# Altium project LEDTapePiHat.PrjPcb
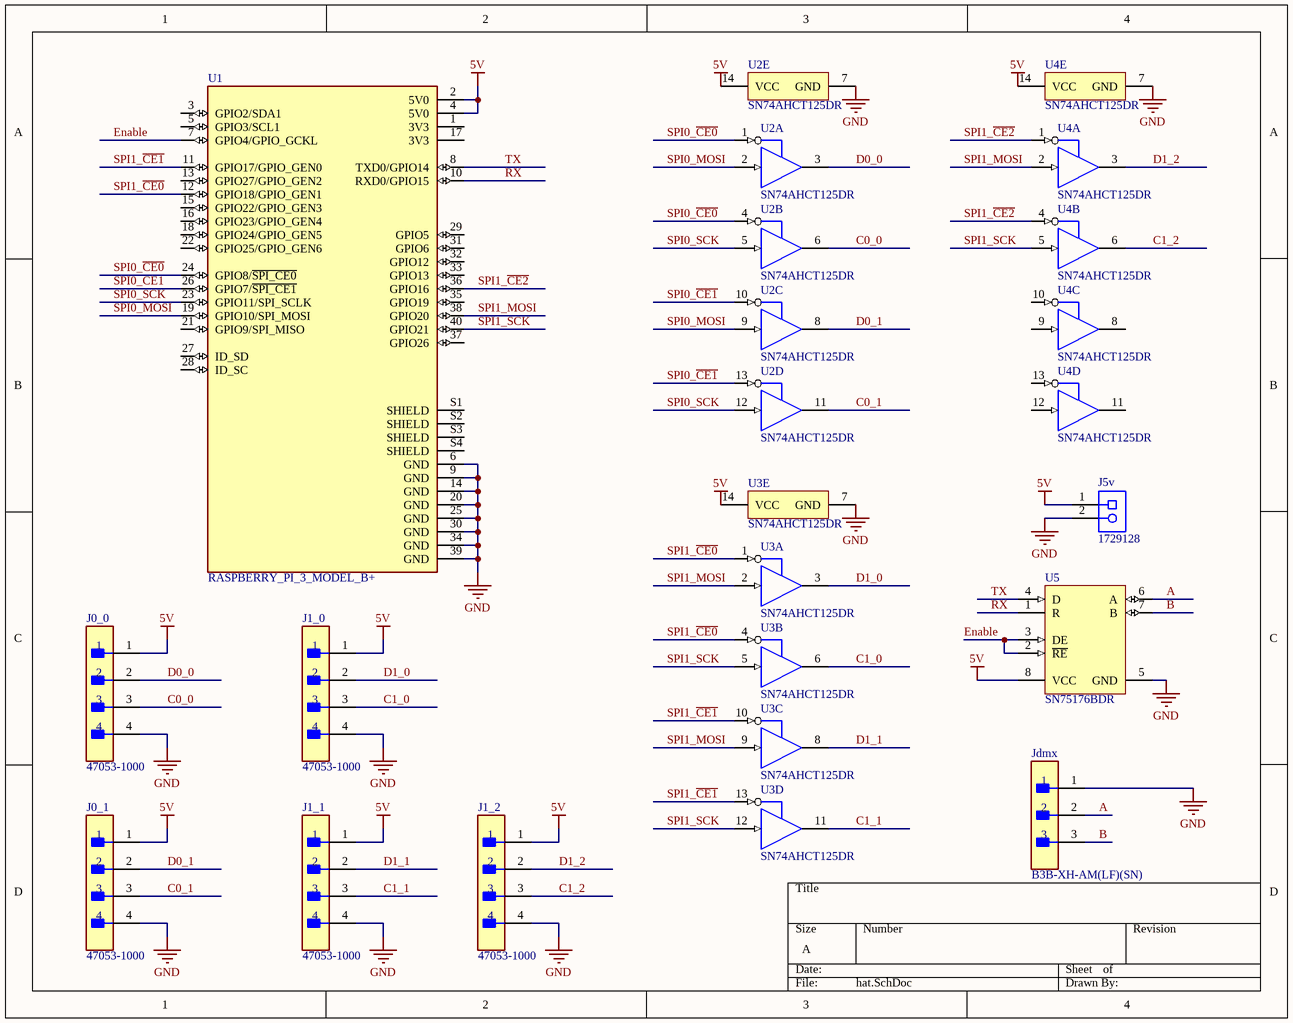
[diagram p0: hat.SchDoc]
1 sheet, 12 parts. Net scope: global (net labels, ports and power ports of the same name join across sheets).
Board file: hat.PcbDoc

## Sheet hat.SchDoc
size A; SheetNumber: 1; SheetTotal: 1

### Parts
J0_0  47053-1000  [FP-47053-1000-MFG]
J0_1  47053-1000  [FP-47053-1000-MFG]
J1_0  47053-1000  [FP-47053-1000-MFG]
J1_1  47053-1000  [FP-47053-1000-MFG]
J1_2  47053-1000  [FP-47053-1000-MFG]
J5v  1729128  [PHOE-1729128-2_V]
Jdmx  B3B-XH-AM(LF)(SN)  [FP-B3B-XH-AM_LF_SN-MFG]
U1  RASPBERRY_PI_3_MODEL_B+  [MODULE_RASPBERRY_PI_3_MODEL_B+]
U2  SN74AHCT125DR  [D0014A_N]  (parts A,B,C,D,E of 5)
U3  SN74AHCT125DR  [D0014A_N]  (parts A,B,C,D,E of 5)
U4  SN74AHCT125DR  [D0014A_N]  (parts A,B,C,D,E of 5)
U5  SN75176BDR  [D0008A_M]

### Nets
5V: J0_0.1 J0_1.1 J1_0.1 J1_1.1 J1_2.1 J5v.1 U1.2(5V0) U1.4(5V0) U2.14(VCC) U3.14(VCC) U4.14(VCC) U5.8(VCC)
GND: J0_0.4 J0_1.4 J1_0.4 J1_1.4 J1_2.4 J5v.2 Jdmx.1 U1.6(GND) U1.9(GND) U1.14(GND) U1.20(GND) U1.25(GND) U1.30(GND) U1.34(GND) U1.39(GND) U2.7(GND) U3.7(GND) U4.7(GND) U5.5(GND)
A: Jdmx.2 U5.6(A)
B: Jdmx.3 U5.7(B)
C0_0: J0_0.3 U2.6(2Y)
C0_1: J0_1.3 U2.11(4Y)
C1_0: J1_0.3 U3.6(2Y)
C1_1: J1_1.3 U3.11(4Y)
C1_2: J1_2.3 U4.6(2Y)
D0_0: J0_0.2 U2.3(1Y)
D0_1: J0_1.2 U2.8(3Y)
D1_0: J1_0.2 U3.3(1Y)
D1_1: J1_1.2 U3.8(3Y)
D1_2: J1_2.2 U4.3(1Y)
Enable: U1.7(GPIO4/GPIO_GCKL) U5.2(~{RE}) U5.3(DE)
RX: U1.10(RXD0/GPIO15) U5.1(R)
SPI0_~{CE0}: U1.24(GPIO8/~{SPI_CE0}) U2.1(1~{OE}) U2.4(2~{OE})
SPI0_~{CE1}: U1.26(GPIO7/~{SPI_CE1}) U2.10(3~{OE}) U2.13(4~{OE})
SPI0_MOSI: U1.19(GPIO10/SPI_MOSI) U2.2(1A) U2.9(3A)
SPI0_SCK: U1.23(GPIO11/SPI_SCLK) U2.5(2A) U2.12(4A)
SPI1_~{CE0}: U1.12(GPIO18/GPIO_GEN1) U3.1(1~{OE}) U3.4(2~{OE})
SPI1_~{CE1}: U1.11(GPIO17/GPIO_GEN0) U3.10(3~{OE}) U3.13(4~{OE})
SPI1_~{CE2}: U1.36(GPIO16) U4.1(1~{OE}) U4.4(2~{OE})
SPI1_MOSI: U1.38(GPIO20) U3.2(1A) U3.9(3A) U4.2(1A)
SPI1_SCK: U1.40(GPIO21) U3.5(2A) U3.12(4A) U4.5(2A)
TX: U1.8(TXD0/GPIO14) U5.4(D)

Not connected (* = marked no-connect by the designer): U1 1(3V3) 3(GPIO2/SDA1) 5(GPIO3/SCL1) 13(GPIO27/GPIO_GEN2) 15(GPIO22/GPIO_GEN3) 16(GPIO23/GPIO_GEN4) 17(3V3) 18(GPIO24/GPIO_GEN5) 21(GPIO9/SPI_MISO) 22(GPIO25/GPIO_GEN6) 27(ID_SD) 28(ID_SC) 29(GPIO5) 31(GPIO6) 32(GPIO12) 33(GPIO13) 35(GPIO19) 37(GPIO26) S1(SHIELD) S2(SHIELD) S3(SHIELD) S4(SHIELD); U4 8(3Y) 9(3A) 10(3~{OE}) 11(4Y) 12(4A) 13(4~{OE})

### Library data of the parts
J0_0 J0_1 J1_0-J1_2 = CMP-04776-000290-1: CONN HEADER VERT 4POS 2.54MM; Number of Positions: 4; Voltage Rating (DC): 250V; Gender: Male; Current Rating: 4A; Glow Wire Compliant: Non-compliant; Contact Material: Brass; Contact Plating: Tin; Radiation Hardening: No; Package Quantity: 12000; Packaging: Bulk; Termination: Through Hole; Depth: 5.84mm; Series: 47053; Number of Contacts: 4; Length: 10.2mm; Halogen Free: Low Halogen; Number of Circuits: 4; Max Operating Temperature: 75°C; Housing Color: Beige; Min Operating Temperature: 0°C; Number of Rows: 1; Pitch: 2.54mm; Housing Material: Nylon; Orientation: Vertical; Mount: Through Hole; Voltage Rating: 250V
J5v = CMP-2000-05815-1: PCB Terminal Block, 13.5 A, 400 V, 2-Pin THD, RoHS, Bulk; Manufacturer: Phoenix Contact; Package Version: 03/2015; No. of Rows: 1; Pitch: 5.08mm; No. of Positions: 2; Voltage Rating: 400V; Current Rating: 13500mA; Manufacturer URL: http://www.phoenixcontact.com/; Datasheet URL: https://datasheet.ciiva.com/16046/1729128-16046181.pdf; RoHS: TRUE; Package URL: https://www.phoenixcontact.com/online/portal/pi/pxc/product_detail_page/!ut/p/b1/3VdJjqNKFDxLH8AFycySyWY2ozFsEPOMMQaDOX1XedGL_1Vdm5YXJleknhSKeBkvI6EA8ncAo3AYoDhBQGco6KN7VURTdemj9us_IEKEZo_YHiPAEWEFmDGOHMORkqKYCORBZxgL7ZoaZYcbFFUZ3fqxSY6GOuxydWUuHqz1ynmMFygu583Bob0Ewr6Sd_l-5m-kAueHiB0jpRwZwe58wwtkpxtMYd_LmGcDRU02dRNEyWt6Y2ti5pSyJ_reIkzIulrqApdnbT11V5jnCKbYNCvhEM1MCpPByat_X379-iThf08CI5GfOPqfBeS3BRoBOdD55AKVv0iLwCMq-2BrzXWSGRH7pUGD9uwXQjiph3xL0DKQwdGa0JImiIOmBNOestqgwTHSSs2oOep-78apyXQBvNi8ZLaFjvjWvcaUEBu0MC6Wbe-d6mB0FAebo2lUWinqYaZs5DAYzV0RP9yitUjnGJ0iI9xhZkT42OCQNUJJhkgWINNQLP2JFP6OpMg3JCVg70jqHT0lvKOnhHf0lPuOnnLf0VPuWx6_dxwUIvwk5WMkT0kLL1mh61l2yZVSzG3pYV_bqo-mj6uMKwKwdnnW8Jh5RTOJzMOA5c-eJDaZQw4mTMPH02PvS_ZAqNVjVTo2WyYLkwH_KU1mmmG5kjRhDqPXLwwVHvVOjCM60-fpXvTDfMGW1PVFVS1r4e4yVDk4ZdNbkUHvqPqQSeian4UD39fNKmachqdJ1NJbyk8rXT9mXTvPk3oE5meulKGgiruPJek-4I9hTT6G8ZLOyRSm2RRVbThERQad5OS28hdt4YW4vG0stgYYzsWsK4_7y6DZMjJSCqri1kyiZR5vD7pwIrNR7QwPHTcLTI5qT7eRlpHrdGiupYlqQDJ7zy_CND8fWWBoLRXxk1RVcXiBQwbTD4Xi7KL-FuO94t9xaqweXzH; PartNumber: 1729128; Package Description: 2-Pin Through Hole Device, Body 8.1 x 10.16 mm, Pitch 5.08 mm; Datasheet Version: 12/2013; Mounting Technology: ThroughHole; Orientation: Horizontal; Package Reference: 1729128-2; Packing: Bulk
Jdmx = CMP-17438-000009-1: CONN HEADER VERT 3POS 2.5MM; Max Current Rating: 3A; Gender: Male; Max Voltage Rating (AC): 250V; Connector Type: Male Pin; Pitch: 0.098inch; Number of Positions: 3; Contact Resistance: 20mR; Termination: Press-Fit; Housing Color: White; Housing Material: Polyamide; Orientation: Straight; Contact Material: Brass; Contact Type: Male Pin; Color: Natural; Packaging: Bulk; Lead Free: Lead Free; Depth: 5.75mm; Number of Rows: 1; Contact Plating: Tin; Length: 9.9mm; Max Operating Temperature: 85°C; Series: XH; Min Operating Temperature: -25°C; Fastening Type: Detent; Mount: Through Hole
U1 = RASPBERRY_PI_3_MODEL_B+: BCM2835 Raspberry Pi Model B+ - ARM11, VideoCore MPU Embedded Evaluation Board; Price: None; MP: RASPBERRY_PI_3_MODEL_B+; Value: *; Availability: Unavailable; Package: None
U2-U4 = CMP-0440-00325-3: Quadruple Bus Buffer Gates With 3-State Outputs, D0014A, LARGE T&R; Manufacturer: Texas Instruments; VCC(Max)(V): 5.5; Output Type: CMOS; tpd @ Nom Voltage(Max)(ns): 8.5; F @ Nom Voltage(Max)(Mhz): 110; ICC @ Nom Voltage(Max)(mA): 0.02; Rating: Catalog; VCC(Min)(V): 4.5; Voltage(Nom)(V): 5; Bits(#): 4; Input Type: TTL; DatasheetVersion: SCLS264O; Generic Part Number: SN74AHCT125; PackageVersion: http://www.ti.com/lit/ml/mpds177g/mpds177g.pdf; Code_JEDEC: MS-012; PackageReference: D0014A; Operating Temperature Range(C): -40 to 125
U5 = CMP-0310-00160-2: Differential Bus Transceiver, 1 TX / 1 RX, 5V, 0 to 70 degC, 8-Pin SOIC (D), Green (RoHS & no Sb/Br); Manufacturer: Texas Instruments; SubFamily: RS-422; Receivers Per Package: 1; ESD(kV): 2; Supply Voltage(s)(V): 5; Rating: Catalog; ICC(Max)(mA): 70; DatasheetVersion: SLLS101D; Code_JEDEC: MS-012AA; PackageReference: D0008A; PackageDescription: 8-Pin Plastic Small Outline Integrated Circuit, 4.9 x 3.9 mm, Pitch 1.27 mm Pitch; ComponentLink1URL: http://www.ti.com/general/docs/lit/getliterature.tsp?genericPartNumber=SN75176B&fileType=pdf; ComponentLink2URL: http://www.ti.com/lit/ml/msoi002j/msoi002j.pdf; Eco-Plan: Green (RoHS & no Sb/Br); Drivers Per Package: 1; Footprint: SN75176; Mounting Technology: Surface Mount; PartNumber: SN75176BDR; ComponentLink2Description: Package Specification; PackageVersion: revM, Jun-2011; # of TX/RX: 1 TX / 1 RX; ComponentLink1Description: Datasheet; Isolated: No